# Altium project PCB_Project.PrjPcb (part 1 of 4)
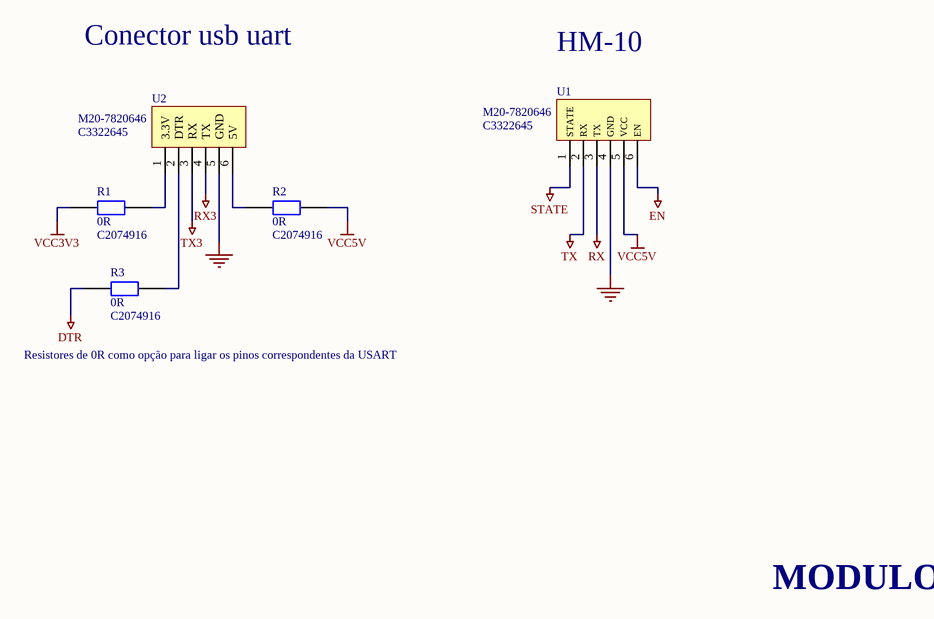
[diagram p0: BLUETOOH.SchDoc]
4 sheets, 42 parts. Net scope: global (net labels, ports and power ports of the same name join across sheets).
Board file: PCB1.PcbDoc
Sheets:
  BLUETOOH.SchDoc
  LOGICA.SchDoc
  Micro.SchDoc
  POWER.SchDoc

## Sheet BLUETOOH.SchDoc
size A4; SheetNumber: 1; SheetTotal: 4

### Parts
R1  0R  LCSC: C2074916  [0r]
R2  0R  LCSC: C2074916  [0r]
R3  0R  LCSC: C2074916  [0r]
U1  M20-7820646  LCSC: C3322645  [6pinFemea]
U2  M20-7820646  LCSC: C3322645  [6pinFemea]

### Nets
DTR: R3.1
EN: U1.6(EN)
GND: U1.4(GND) U2.5(GND)
RX: U1.3(TX)
RX3: U2.4(TX)
STATE: U1.1(STATE)
TX: U1.2(RX)
TX3: U2.3(RX)
VCC3V3: R1.1
VCC5V: R2.2 U1.5(VCC)
NetR1_2: R1.2 U2.1(3.3V)
NetR2_1: R2.1 U2.6(5V)
NetR3_2: R3.2 U2.2(DTR)

### Notes on the sheet
- Conector usb uart
- HM-10
- Resistores de 0R como opção para ligar os pinos correspondentes da USART
- MODULOS

### Library data of the parts
R1-R3 = MCU08050Z0000ZP500: Zero Ohm Resistor, Jumper, 0805 [2012 Metric], Thin Film, 200 mW, 1.5 A, Surface Mount Device; Manufacturer: Vishay; Max Power Dissipation: 200mW; Power Dissipation: 125mW; Value: 0Ω; Voltage Rating: 150V; Supplier: Avnet; Supplier Part Number: MCU08050Z0000ZP500; Manufacturer Part Number: MCU08050Z0000ZP500; RoHS: Compliant; Category: Chip SMD Resistors; Stock: 5000; Pricing: 5000=0,03643, 10000=0,03612, 20000=0,0355, 30000=0,03488, 40000=0,03426 (USD); Case/Package: 0805; Case Code (Imperial): 0805; Case Code (Metric): 2012; China RoHS: Non-Compliant; Composition: Thin Film; Contact Plating: Tin; Depth: 1.25mm; Height: 450µm; Lead Free: Lead Free; Lifecycle Status: Production; Max Operating Temperature: 125°C; Military Standard: Not; Min Operating Temperature: -55°C; Mounting Technology: Surface Mount; Number of Terminals: 2; Number of Terminations: 2; Power Rating: 200mW; Radiation Hardening: No; REACH SVHC: Yes; Voltage Rating (DC): 150V; Width: 1.25mm; ComponentLink1URL: https://datasheet.octopart.com:443/MCU08050Z0000ZP500-Vishay-datasheet-182027961.pdf?src-supplier=IHS; ComponentLink1Description: https://datasheet.octopart.com:443/MCU08050Z0000ZP500-Vishay-datasheet-182027961.pdf?src-supplier=IHS; ComponentLink2URL: https://datasheet.octopart.com:443/MCU08050Z0000ZP500-Vishay-datasheet-81842982.pdf?src-supplier=Upverter; ComponentLink2Description: https://datasheet.octopart.com:443/MCU08050Z0000ZP500-Vishay-datasheet-81842982.pdf?src-supplier=Upverter; ComponentLink3URL: https://datasheet.octopart.com:443/MCU08050Z0000ZP500-Vishay-datasheet-190005737.pdf?src-supplier=TME; ComponentLink3Description: https://datasheet.octopart.com:443/MCU08050Z0000ZP500-Vishay-datasheet-190005737.pdf?src-supplier=TME; ComponentLink4URL: https://datasheet.octopart.com:443/MCU08050Z0000ZP500-Vishay-datasheet-66078241.pdf?src-supplier=Newark; ComponentLink4Description: https://datasheet.octopart.com:443/MCU08050Z0000ZP500-Vishay-datasheet-66078241.pdf?src-supplier=Newark; ComponentLink5URL: https://datasheet.octopart.com:443/MCU08050Z0000ZP500-Vishay-datasheet-178522811.pdf?src-supplier=Newark; ComponentLink5Description: https://datasheet.octopart.com:443/MCU08050Z0000ZP500-Vishay-datasheet-178522811.pdf?src-supplier=Newark; ComponentLink6URL: https://datasheet.octopart.com:443/MCU08050Z0000ZP500-Vishay-datasheet-112277133.pdf?src-supplier=Newark; ComponentLink6Description: https://datasheet.octopart.com:443/MCU08050Z0000ZP500-Vishay-datasheet-112277133.pdf?src-supplier=Newark; ComponentLink7URL: https://datasheet.octopart.com/MCU08050Z0000ZP500-Vishay-datasheet-12543201.pdf; ComponentLink7Description: https://datasheet.octopart.com/MCU08050Z0000ZP500-Vishay-datasheet-12543201.pdf; ComponentLink8URL: https://datasheet.octopart.com/MCU08050Z0000ZP500-Vishay-datasheet-12532999.pdf; ComponentLink8Description: https://datasheet.octopart.com/MCU08050Z0000ZP500-Vishay-datasheet-12532999.pdf; ComponentLink9URL: https://datasheet.octopart.com/MCU08050Z0000ZP500-Vishay-datasheet-12520289.pdf; ComponentLink9Description: https://datasheet.octopart.com/MCU08050Z0000ZP500-Vishay-datasheet-12520289.pdf; ComponentLink10URL: https://datasheet.octopart.com/MCU08050Z0000ZP500-Vishay-datasheet-12510709.pdf; ComponentLink10Description: https://datasheet.octopart.com/MCU08050Z0000ZP500-Vishay-datasheet-12510709.pdf; ComponentLink11URL: https://datasheet.octopart.com:443/MCU08050Z0000ZP500-Vishay-datasheet-57863180.pdf?src-supplier=Future+Electronics; ComponentLink11Description: https://datasheet.octopart.com:443/MCU08050Z0000ZP500-Vishay-datasheet-57863180.pdf?src-supplier=Future+Electronics; ComponentLink12URL: https://datasheet.octopart.com:443/MCU08050Z0000ZP500-Vishay-datasheet-11731685.pdf?src-supplier=Arrow+Electronics; ComponentLink12Description: https://datasheet.octopart.com:443/MCU08050Z0000ZP500-Vishay-datasheet-11731685.pdf?src-supplier=Arrow+Electronics; ComponentLink13URL: http://sigma.octopart.com:80/rohs_statement/Vishay-company-15.pdf?src-supplier=Compliance+Statements; ComponentLink13Description: http://sigma.octopart.com:80/rohs_statement/Vishay-company-15.pdf?src-supplier=Compliance+Statements
U1 U2 = M20-7820646: Conn Socket Strip Receptacle 6 Position 2.54mm Solder Straight Through Hole Tube; Manufacturer: Harwin; Connector Type: Receptacle, Socket; Contact Resistance: 20mΩ; Current Rating: 3A; Dielectric Material: Polyamide; Gender: Female; Insulation Resistance: 1GΩ; Number of Contacts: 6; Supplier: DigiKey; Supplier Part Number: 952-1809-ND; Manufacturer Part Number: M20-7820646; RoHS: Compliant; Category: Card Edge Connectors; Stock: 414; Pricing: 1=1,11, 36=0,86417, 108=0,79954, 504=0,7171, 1008=0,68287, 5004=0,60989, 10008=0,58081 (USD); Case/Package: SIL; Color: Black; Contact Gender: Female; Contact Material: Bronze; Contact Plating: Tin; Depth: 2.5mm; Housing Color: Black; Housing Material: Nylon; Length: 15.64mm; Lifecycle Status: Production; Max Current Rating: 3A; Max Operating Temperature: 105°C; Min Operating Temperature: -40°C; Mounting Technology: Through Hole; Pins: 6; Number of Positions: 6; Number of Rows: 1; Orientation: Straight; Pitch: 2.54mm; Radiation Hardening: No; REACH SVHC: Yes; Terminal Pitch: 2.54mm; Termination: Solder; ComponentLink1URL: https://datasheet.octopart.com:443/M20-7820646-Harwin-datasheet-176383844.pdf?src-supplier=Newark; ComponentLink1Description: https://datasheet.octopart.com:443/M20-7820646-Harwin-datasheet-176383844.pdf?src-supplier=Newark; ComponentLink2URL: https://datasheet.octopart.com:443/M20-7820646-Harwin-datasheet-99119574.pdf?src-supplier=Farnell; ComponentLink2Description: https://datasheet.octopart.com:443/M20-7820646-Harwin-datasheet-99119574.pdf?src-supplier=Farnell; ComponentLink3URL: https://datasheet.octopart.com:443/M20-7820646-Harwin-datasheet-188872139.pdf?src-supplier=TME; ComponentLink3Description: https://datasheet.octopart.com:443/M20-7820646-Harwin-datasheet-188872139.pdf?src-supplier=TME; ComponentLink4URL: https://datasheet.octopart.com:443/M20-7820646-Harwin-datasheet-137074310.pdf?src-supplier=X-ON; ComponentLink4Description: https://datasheet.octopart.com:443/M20-7820646-Harwin-datasheet-137074310.pdf?src-supplier=X-ON; ComponentLink5URL: http://sigma.octopart.com:80/15888285/rohs_statement/Harwin-M20-7820646.pdf?src-supplier=Compliance+Statements; ComponentLink5Description: http://sigma.octopart.com:80/15888285/rohs_statement/Harwin-M20-7820646.pdf?src-supplier=Compliance+Statements

## Sheet LOGICA.SchDoc
size A4; SheetNumber: 2; SheetTotal: 4
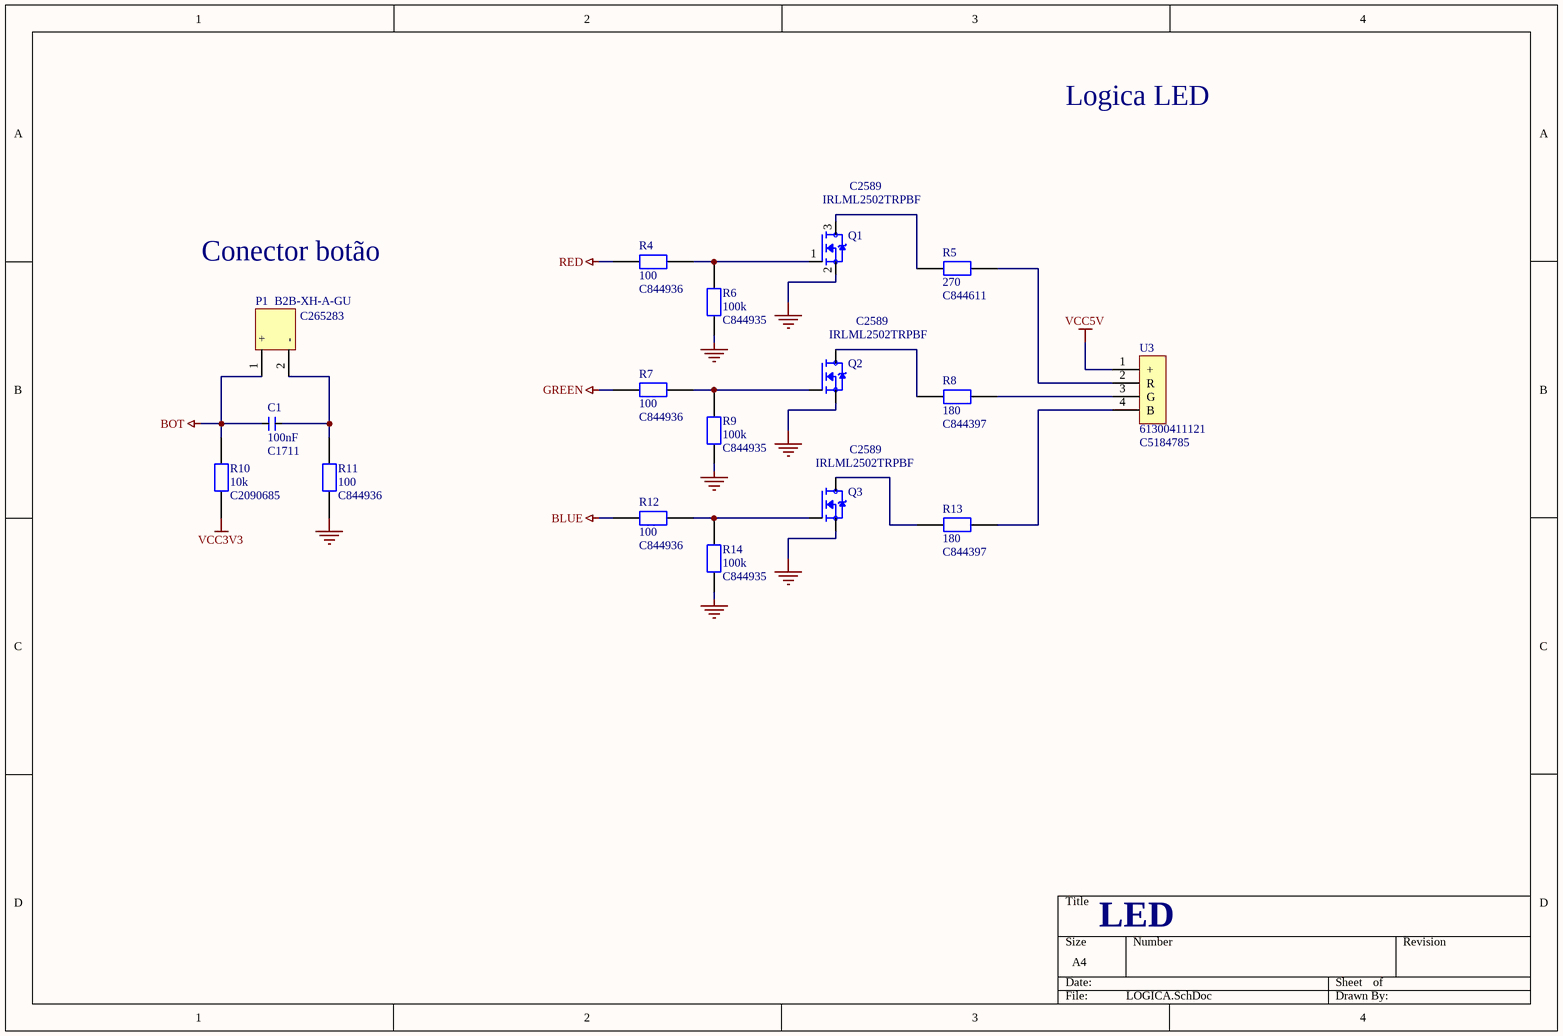
[diagram p1: LOGICA.SchDoc]

### Parts
C1  100nF  LCSC: C1711  [0805_samsung]
P1  B2B-XH-A-GU  LCSC: C265283  [conector2.54mm]
Q1  IRLML2502TRPBF  LCSC: C2589  [mosfet]
Q2  IRLML2502TRPBF  LCSC: C2589  [mosfet]
Q3  IRLML2502TRPBF  LCSC: C2589  [mosfet]
R4  100  LCSC: C844936  [100Resistor]
R5  270  LCSC: C844611  [270Resistor]
R6  100k  LCSC: C844935  [100kResistor]
R7  100  LCSC: C844936  [100Resistor]
R8  180  LCSC: C844397  [180Resistor]
R9  100k  LCSC: C844935  [100kResistor]
R10  10k  LCSC: C2090685  [10kResistor]
R11  100  LCSC: C844936  [100Resistor]
R12  100  LCSC: C844936  [100Resistor]
R13  180  LCSC: C844397  [180Resistor]
R14  100k  LCSC: C844935  [100kResistor]
U3  61300411121  LCSC: C5184785  [conector4pinos]

### Nets
BLUE: R12.1
BOT: C1.1 P1.1(+) R10.2
GND: Q1.2(S) Q2.2(S) Q3.2(S) R6.1 R9.1 R11.2 R14.1
GREEN: R7.1
RED: R4.1
VCC3V3: R10.1
VCC5V: U3.1(+)
NetC1_2: C1.2 P1.2(-) R11.1
NetQ1_1: Q1.1(G) R4.2 R6.2
NetQ1_3: Q1.3(D) R5.1
NetQ2_1: Q2.1(G) R7.2 R9.2
NetQ2_3: Q2.3(D) R8.1
NetQ3_1: Q3.1(G) R12.2 R14.2
NetQ3_3: Q3.3(D) R13.1
NetR5_2: R5.2 U3.2(R)
NetR8_2: R8.2 U3.3(G)
NetR13_2: R13.2 U3.4(B)

### Notes on the sheet
- Logica LED
- Conector botão
- LED